# Altium schematic sheet Temperature Sensors.SchDoc
size A4; SheetNumber: 4; SheetTotal: 6
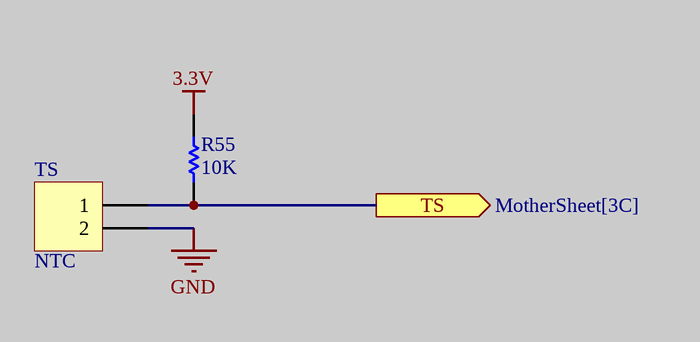
[diagram p0: Temperature Sensors.SchDoc]

## Parts
R55  10K  [RESC0603]
TS  NTC  [HEADER1*2 xn]

## Ports
TS (out, see MotherSheet[3C])

## Nets
3.3V: R55.2
GND: TS.2
TS: R55.1 TS.1 ; port TS

## Library data of the parts
R55 = Resistor: 0603,0.1W; Published: 8-Jun-2000; LatestRevisionDate: 17-Jul-2002; LatestRevisionNote: Re-released for DXP Platform.; PackageReference: AXIAL-0.5; Publisher: Altium Limited; Value: 10K
TS = Header1*2 XN: Header, 2-Pin XN